# EAGLE design ItsyBitsy Display Add-On (EAGLE 9.6.2)
COMPANY: ADAFRUIT INDUSTRIES; DRAWN: KTOWN; REV: B
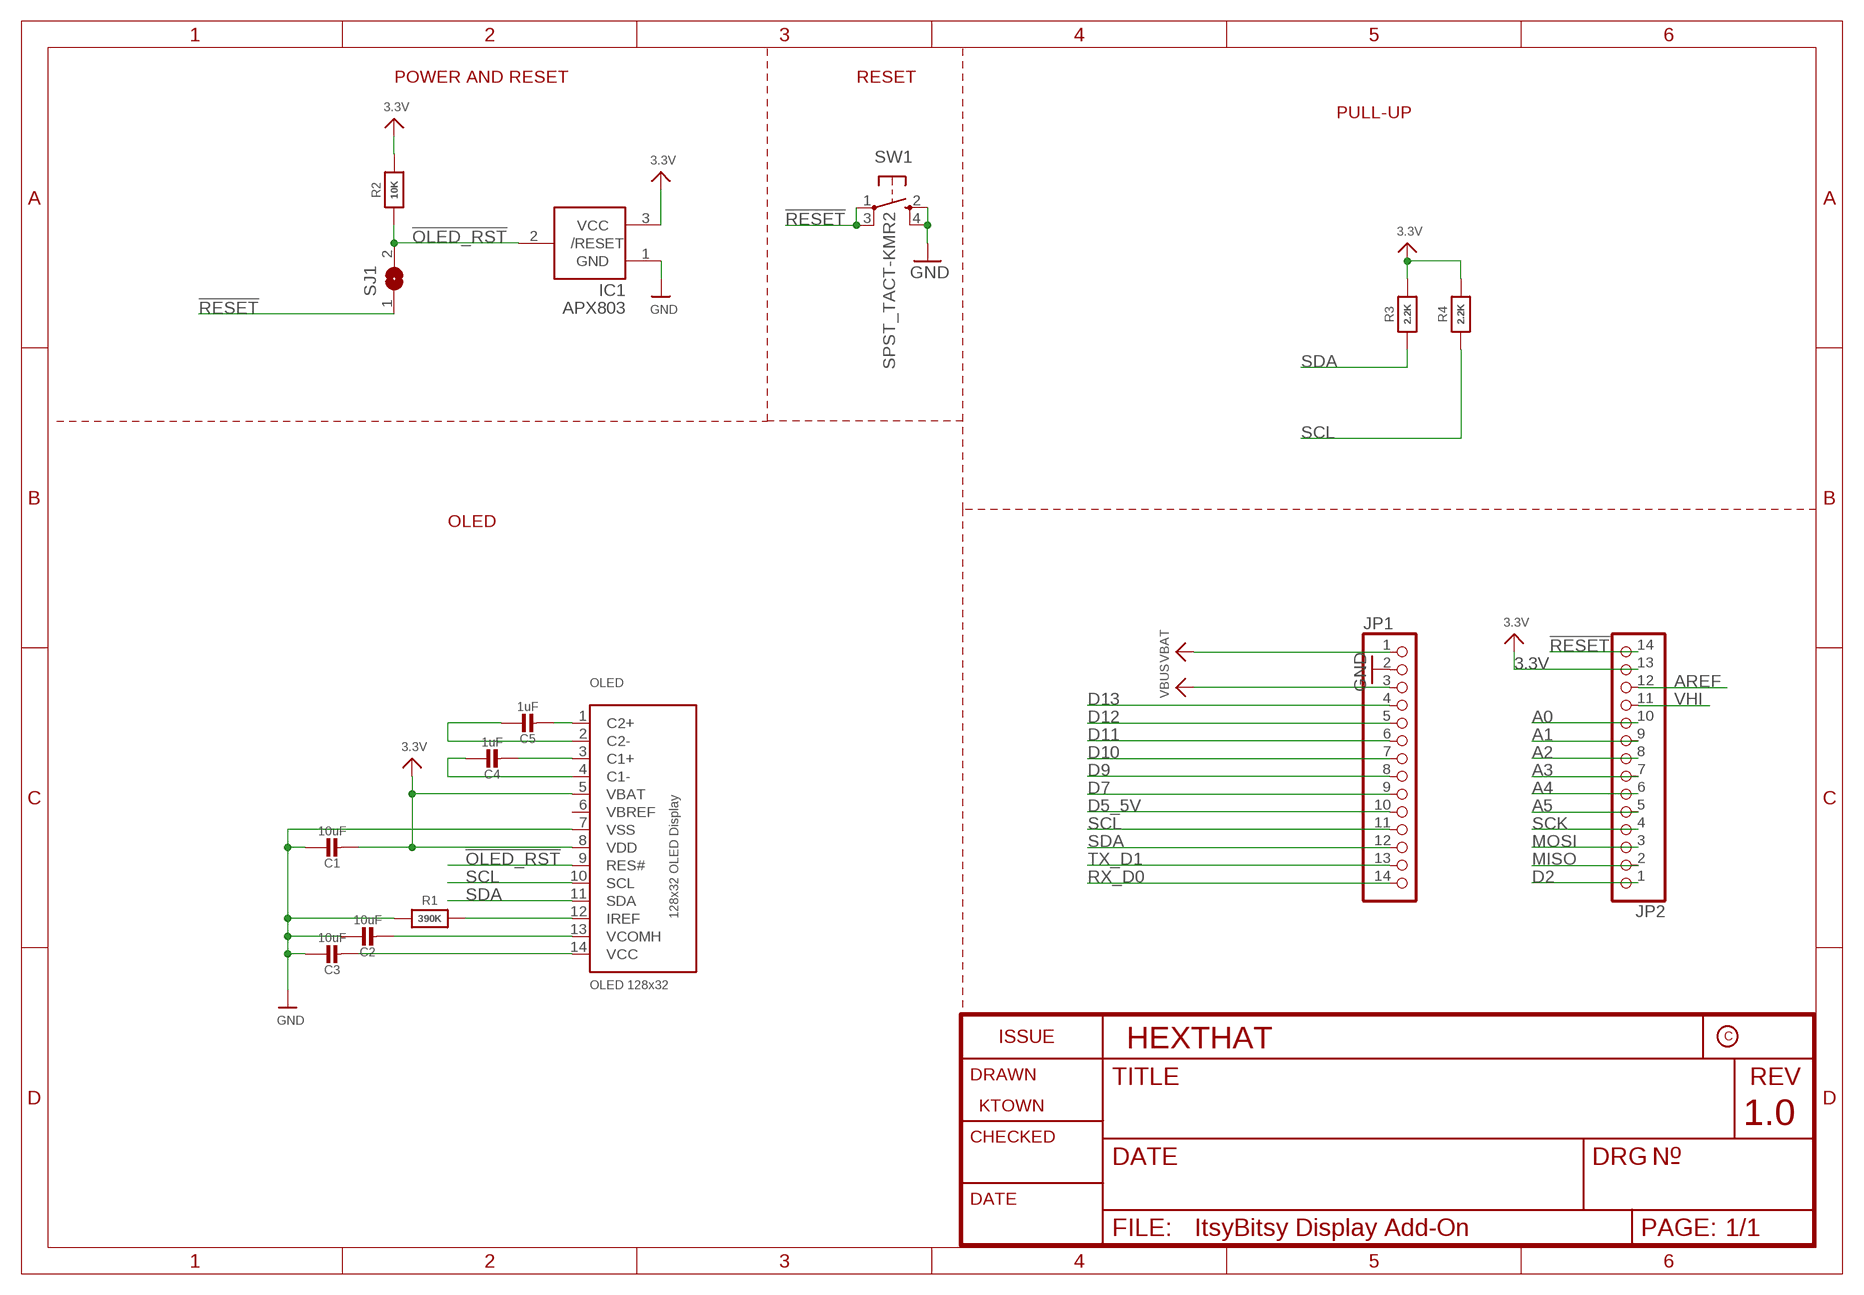
[diagram p0: schematic, sheet 1]
FRAME1 (FRAME_A4): COMPANY: HEXTHAT; REV: 1.0

## Parts
C1  10uF  CAP_CERAMIC0805-NOOUTLINE  [0805-NO]
C2  10uF  CAP_CERAMIC0805-NOOUTLINE  [0805-NO]
C3  10uF  CAP_CERAMIC0805-NOOUTLINE  [0805-NO]
C4  1uF  CAP_CERAMIC0805-NOOUTLINE  [0805-NO]
C5  1uF  CAP_CERAMIC0805-NOOUTLINE  [0805-NO]
IC1  APX803  AXP083-SAG  [SOT23]
JP1  HEADER-1X14  [1X14_ROUND70]
JP2  HEADER-1X14  [1X14_ROUND70]
OLED  OLED 128x32  DISP_OLED_UG-2832HSWEG02  [UG-2832HSWEG02_WRAPUNDER]
R1  390K  RESISTOR0805_NOOUTLINE  [0805-NO]
R2  10K  RESISTOR_0805MP  [_0805MP]
R3  2.2K  RESISTOR0805_NOOUTLINE  [0805-NO]
R4  2.2K  RESISTOR0805_NOOUTLINE  [0805-NO]
SJ1  SOLDERJUMPER  [SOLDERJUMPER_ARROW_NOPASTE]
SW1  SPST_TACT-KMR2  [KMR2]

## Nets
3.3V: C1.2 IC1.3(VCC) JP2.13 OLED.5(VBAT) OLED.8(VDD) R2.2 R3.2 R4.2
!OLED_RST: IC1.2(/RESET) OLED.9(RES#) R2.1 SJ1.2
!RESET: JP2.14 SJ1.1 SW1.1(P) SW1.3(P1)
A0: JP2.10
A1: JP2.9
A2: JP2.8
A3: JP2.7
A4: JP2.6
A5: JP2.5
AREF: JP2.12
C1N: C4.1 OLED.4(C1-)
C1P: C4.2 OLED.3(C1+)
C2N: C5.1 OLED.2(C2-)
C2P: C5.2 OLED.1(C2+)
D2: JP2.1
D5_5V: JP1.10
D7: JP1.9
D9: JP1.8
D10: JP1.7
D11: JP1.6
D12: JP1.5
D13: JP1.4
GND: C1.1 C2.1 C3.1 IC1.1(GND) JP1.2 OLED.7(VSS) R1.1 SW1.2(S) SW1.4(S1)
IREF: OLED.12(IREF) R1.2
MISO: JP2.2
MOSI: JP2.3
RX_D0: JP1.14
SCK: JP2.4
SCL: JP1.11 OLED.10(SCL) R4.1
SDA: JP1.12 OLED.11(SDA) R3.1
TX_D1: JP1.13
VBAT: JP1.1
VBUS: JP1.3
VCC: C3.2 OLED.14(VCC)
VCOMH: C2.2 OLED.13(VCOMH)
VHI: JP2.11

## Notes on the sheet
- POWER AND RESET | RESET
- PULL-UP
- OLED

## Power pins joined to a net without a drawn wire
VBREF: OLED.6(VBREF)

## Library data of the parts
C1-C5 = microbuilder:CAP_CERAMIC: Ceramic Capacitors For new designs, use the packages preceded by an '_' character since they are more reliable: The following footprints should be used on most boards: _0402 - Standard footprint for regular board layouts _0603 - Standard footprint for regular board layouts _0805 - Standard footprint for regular board layouts _1206 - Standard footprint for regular board layouts For extremely tight-pitch boards where space is at a premium, the following 'micro-pitch' footprints can be used (smaller pads, no silkscreen outline, etc.): _0402MP - Micro-pitch footprint for very dense/compact boards _0603MP - Micro-pitch footprint for very dense/compact boards _0805MP - Micro-pitch footprint for very dense/compact boards _1206MP - Micro-pitch footprint for very dense/compact boards
IC1 = adafruit:AXP083
JP1 JP2 = microbuilder:HEADER-1X14
OLED = microbuilder:DISP_OLED_UG-2832HSWEG02: 128x32 I2C 0.91" Monochrome OLED Display
R1-R4 = microbuilder:RESISTOR: Resistors For new designs, use the packages preceded by an '_' character since they are more reliable: The following footprints should be used on most boards: _0402 - Standard footprint for regular board layouts _0603 - Standard footprint for regular board layouts _0805 - Standard footprint for regular board layouts _1206 - Standard footprint for regular board layouts For extremely tight-pitch boards where space is at a premium, the following 'micro-pitch' footprints can be used (smaller pads, no silkscreen outline, etc.): _0402MP - Micro-pitch footprint for very dense/compact boards _0603MP - Micro-pitch footprint for very dense/compact boards _0805MP - Micro-pitch footprint for very dense/compact boards _1206MP - Micro-pitch footprint for very dense/compact boards
SJ1 = microbuilder:SOLDERJUMPER: SMD Solder JUMPER Solder the two pads together to create a connection, or remove the solder to break it. REFLOW - Use this footprint for solder paste and reflow ovens. WAVE - Use this footprint for hand-soldering (larger pads). CLOSED - Has a trace between the two pads to ensure it is closed by default. The trace needs to be cut to disable the jumper, and can be closed again by creating a solder bridge between the two pads.; BOM: EXCLUDE
SW1 = adafruit:SPST_TACT: SMT 6mm switch, EVQQ2 series http://www.ladyada.net/library/eagle

## Board
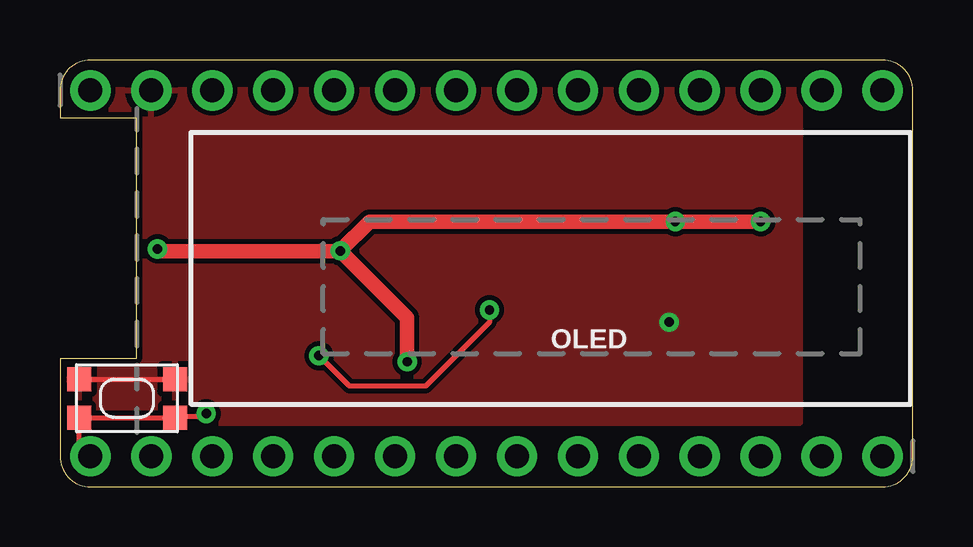
[diagram p1: board, top side]
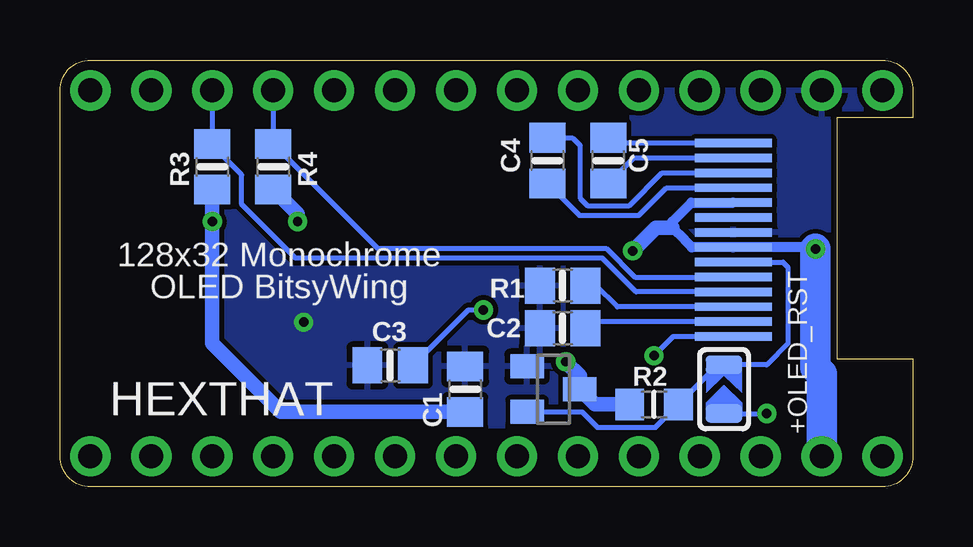
[diagram p2: board, bottom side, seen from below]

Size 35.56 x 17.78 mm. Coordinates in mm from the lower left corner, seen from the top.
Outline: 0,5.33 0,1.27 arc90 1.27,0 34.29,0 arc90 35.56,1.27 35.56,16.51 arc90 34.29,17.78 1.27,17.78 arc90 0,16.51 0,15.37 3.17,15.37 3.17,5.33 0,5.33
Copper layers (1*16): Top 0.035mm / dielectric 1.5mm / Bottom 0.035mm
Design rules "adafruit *": minimum track width 8mil, minimum drill 15.5mil, track to track 8mil, track to pad 8mil, pad to pad 8mil, via to via 8mil, smd to smd 8mil, copper to edge 10mil, drill to drill 8mil, minimum pad ring 10mil, minimum via ring 8mil, stop-mask expansion 2mil, vias tented up to drill 20mil, thermal gap 10mil

### Footprints (pad centres in the part's own frame; a part is rotated, then mirrored left to right if it is on the bottom)
0805-NO = smd 1.24 x 1.5: 1 -0.95,0; 2 0.95,0
SOT23 = smd 1 x 1.4: 1 -0.95,-1.1; 2 0.95,-1.1; 3 0,1.1
1X14_ROUND70 = drill 1 pad 1.676: 1 -16.51,0; 2 -13.97,0; 3 -11.43,0; 4 -8.89,0; 5 -6.35,0; 6 -3.81,0; 7 -1.27,0; 8 1.27,0; 9 3.81,0; 10 6.35,0; 11 8.89,0; 12 11.43,0; 13 13.97,0; 14 16.51,0
UG-2832HSWEG02_WRAPUNDER = smd 3.2 x 0.35 bottom: 1 -2.03,-5.3; 2 -2.03,-4.68; 3 -2.03,-4.06; 4 -2.03,-3.44; 5 -2.03,-2.82; 6 -2.03,-2.2; 7 -2.03,-1.58; 8 -2.03,-0.96; 9 -2.03,-0.34; 10 -2.03,0.28; 11 -2.03,0.9; 12 -2.03,1.52; 13 -2.03,2.14; 14 -2.03,2.76
_0805MP = smd 1.2 x 1.3: 1 -1.016,0; 2 1.016,0
SOLDERJUMPER_ARROW_NOPASTE = smd 0.762 x 1.524: 1 -1.016,0; 2 1.016,0
KMR2 = smd 1 x 1: 1 2,0.8; 2 2,-0.8; 3 -2,0.8; 4 -2,-0.8

### Placement (x,y rotation side)
C1  18.67,4.06 270 bottom
C2  14.61,6.6 0 bottom
C3  21.79,5.05 0 bottom
C4  15.24,13.59 90 bottom
C5  12.7,13.59 90 bottom
IC1  14.99,4.06 270 bottom
JP1  17.78,16.51 0 top
JP2  17.78,1.27 180 top
OLED  5.46,9.02 180 top
R1  14.61,8.38 0 bottom
R2  10.79,3.43 180 bottom
R3  29.21,13.34 270 bottom
R4  26.67,13.34 270 bottom
SJ1  7.87,4.06 90 bottom
SW1  2.79,3.68 180 top

### Tracks (layer width: path | path; a pad name or v marks a point on that pad's centre or on a via)
3.3V  (via drill 0.39)
  Top 0.61: v29.21,11.05 v25.65,11.05 12.91,11.05 v11.69,9.83 v11.68,9.83 | v11.68,9.83 v11.69,9.83 11.66,9.8 4.17,9.8 v4.06,9.91 | v14.48,5.21 14.48,7.04 v11.68,9.83
  Bottom 0.406: OLED.5 9.24,11.84 10.03,11.05 10.03,10.79 9.5,10.26 9.5,10.25 9.22,9.98 OLED.8 4.5,9.98 | v4.06,9.91 4.06,10.14
  Bottom 0.61: 10.03,10.79 10.72,10.79 v11.68,9.83 | R2.2 13.25,3.43 IC1.3 13.89,4.62 v14.48,5.21 | C1.2 26.36,3.11 29.21,5.97 v29.21,11.05 R3.2 | R4.2 25.65,11.37 v25.65,11.05
  Bottom 1.27: v4.06,9.91 4.06,4.97 3.81,4.71 JP2.13
!OLED_RST
  Bottom 0.203: IC1.2 13.8,3.11 13.16,2.47 10.73,2.47 R2.1 8.13,5.08 SJ1.2 6.1,5.08 5.21,5.97 5.21,9.14 5.42,9.36 OLED.9
!RESET  (via drill 0.39)
  Top 0.203: JP2.14 0.79,1.75 SW1.1 SW1.3 4.83,2.92 5.97,2.92 v6.1,3.05
  Bottom 0.203: SJ1.1 v6.1,3.05
C1N
  Bottom 0.203: C4.1 13.9,11.3 11.43,11.3 10.28,12.46 OLED.4
C1P
  Bottom 0.203: C4.2 14.2,14.54 13.88,14.22 13.88,12.02 13.58,11.71 11.82,11.71 10.46,13.08 OLED.3
C2N
  Bottom 0.203: C5.1 11.64,13.7 OLED.2
C2P
  Bottom 0.203: OLED.1 12.48,14.32 C5.2
GND  (via drill 0.39)
  Top 0.203: SW1.2 SW1.4
  other vias: 25.4,6.86
  pour Top: 0,16.51 0,2.67 30.86,2.67 30.86,16.51
  pour Bottom: 0,16.51 0,2.54 35.56,2.54 35.56,16.51
IREF
  Bottom 0.203: OLED.12 12.32,7.5 13.21,8.38 R1.2
SCL
  Bottom 0.203: JP1.11 R4.1 22.32,9.93 12.79,9.93 11.59,8.74 OLED.10
SDA
  Bottom 0.203: JP1.12 R3.1 29.21,14.22 27.98,12.99 27.98,11.77 25.74,9.53 12.95,9.53 11.55,8.12 OLED.11
VCC  (via drill 0.39)
  Top 0.203: v17.91,7.37 17.91,6.86 15.24,4.19 12.06,4.19 v10.79,5.46
  Bottom 0.203: 8.59,6.26 OLED.14 10,6.26 v10.79,5.46 | 20.84,5.7 C3.2 18.53,7.37 v17.91,7.37
VCOMH
  Bottom 0.203: OLED.13 13.38,6.88 C2.2

### Text on the board
bPlace: 128x32 Monochrome / OLED BitsyWing | +OLED_RST | HEXTHAT